# Altium schematic sheet SinCos.SchDoc
size A4
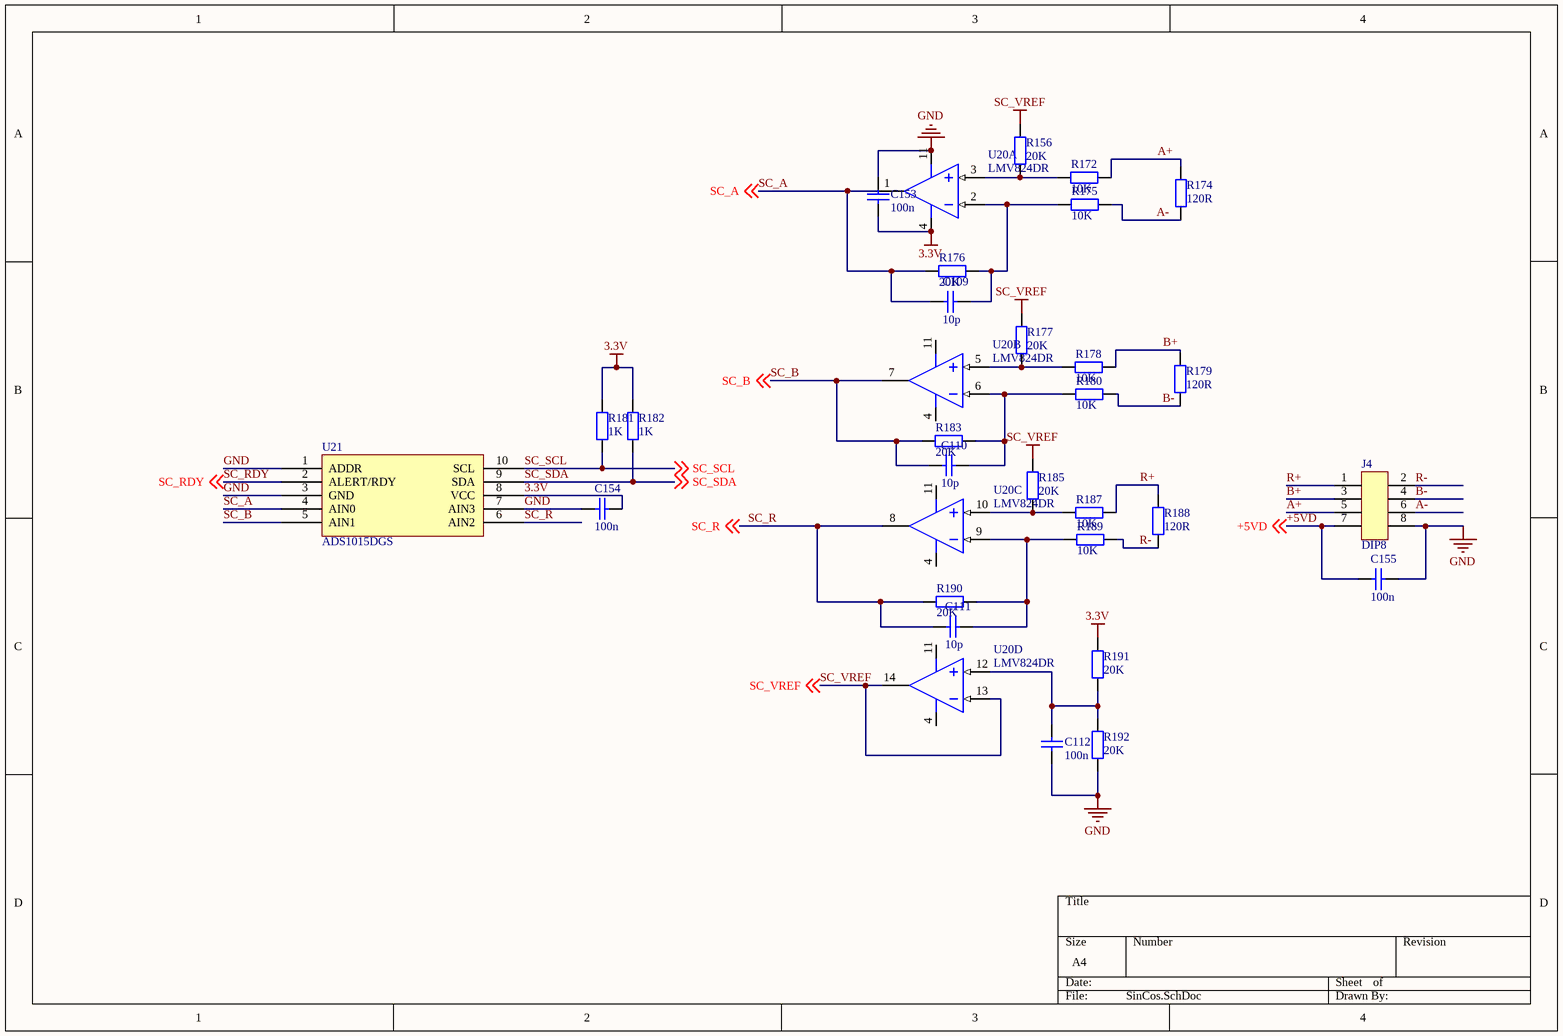
[diagram p0: SinCos.SchDoc]

## Parts
C109  10p  [0603C]
C110  10p  [0603C]
C111  10p  [0603C]
C112  100n  [0603C]
C153  100n  [0603C]
C154  100n  [0603C]
C155  100n  [0603C]
J4  DIP8  [DIP8-2.54]
R156  20K  [0603R]
R172  10K  [0603R]
R174  120R  [0603R]
R175  10K  [0603R]
R176  20K  [0603R]
R177  20K  [0603R]
R178  10K  [0603R]
R179  120R  [0603R]
R180  10K  [0603R]
R181  1K  [0603R]
R182  1K  [0603R]
R183  20K  [0603R]
R185  20K  [0603R]
R187  10K  [0603R]
R188  120R  [0603R]
R189  10K  [0603R]
R190  20K  [0603R]
R191  20K  [0603R]
R192  20K  [0603R]
U20  LMV824DR  [SOP-14]  (parts A,B,C,D of 4)
U21  ADS1015DGS  [VSSOP-10]

## Nets
3.3V: C153.1 C154.1 R181.1 R182.1 R191.1 U20.4(GND) U21.8(VCC)
GND: C112.1 C153.2 C154.2 C155.1 J4.8 R192.2 U20.11(V+) U21.1(ADDR) U21.3(GND) U21.7(AIN3)
SC_VREF: R156.1 R177.1 R185.1 U20.13(IN-) U20.14(OUT) ; off-sheet SC_VREF
+5VD: C155.2 J4.7 ; off-sheet +5VD
A+: J4.5 R172.1 R174.1
A-: J4.6 R174.2 R175.1
B+: J4.3 R178.1 R179.1
B-: J4.4 R179.2 R180.1
R+: J4.1 R187.1 R188.1
R-: J4.2 R188.2 R189.1
SC_A: C109.1 R176.1 U20.1(OUT) U21.4(AIN0) ; off-sheet SC_A
SC_B: C110.1 R183.1 U20.7(OUT2) U21.5(AIN1) ; off-sheet SC_B
SC_R: C111.1 R190.1 U20.8(OUT) U21.6(AIN2) ; off-sheet SC_R
SC_RDY: U21.2(ALERT/RDY) ; off-sheet SC_RDY
SC_SCL: R181.2 U21.10(SCL) ; off-sheet SC_SCL
SC_SDA: R182.2 U21.9(SDA) ; off-sheet SC_SDA
NetC109_2: C109.2 R175.2 R176.2 U20.2(IN-)
NetC110_2: C110.2 R180.2 R183.2 U20.6(IN-)
NetC111_2: C111.2 R189.2 R190.2 U20.9(IN-)
NetC112_2: C112.2 R191.2 R192.1 U20.12(IN+)
NetR156_2: R156.2 R172.2 U20.3(IN+)
NetR177_2: R177.2 R178.2 U20.5(IN+)
NetR185_2: R185.2 R187.2 U20.10(IN+)

## Library data of the parts
C109-C112 C153-C155 = Cap: Capacitor; Value: 100pF; Published: 8-Jun-2000; LatestRevisionDate: 17-Jul-2002; LatestRevisionNote: Re-released for DXP Platform.; PackageReference: RAD-0.3; Publisher: Altium Limited
J4 = DIP8: Connectors; Set Position: 0.5; Published: 8-Jun-2000; LatestRevisionDate: 17-Jul-2002; LatestRevisionNote: Re-released for DXP Platform.; PackageReference: AXIAL-0.6; Publisher: Altium Limited
R156 R172 R174-R180 R183 R185 R187-R192 = Res2: Resistor; Value: 1K; Published: 8-Jun-2000; LatestRevisionDate: 17-Jul-2002; LatestRevisionNote: Re-released for DXP Platform.; PackageReference: AXIAL-0.4; Publisher: Altium Limited
R181 R182 = Res2: Resistor; Published: 8-Jun-2000; LatestRevisionDate: 17-Jul-2002; LatestRevisionNote: Re-released for DXP Platform.; PackageReference: AXIAL-0.4; Publisher: Altium Limited; Value: 1K
U20 = LM339AD: Quad Single-Supply Comparator; Published: 17-Jul-2002; LatestRevisionDate: 13-Apr-2006; LatestRevisionNote: IPC-7351 Footprint Added.; DatasheetVersion: 1988; PackageVersion: 1991; PackageReference: 751A-02; Publisher: Altium Limited; PackageDescription: 14-Pin Small Outline Integrated Circuit 1.27 mm Pitch; Code_IPC: SOIC127P600-14; ComponentLink1Description: Manufacturer Link; ComponentLink1URL: http://www.onsemi.com/site/products/taxonomy/0,4438,133,00.html
U21 = ADS1015